# Altium schematic sheet BatteryCharger.SchDoc
size Tabloid
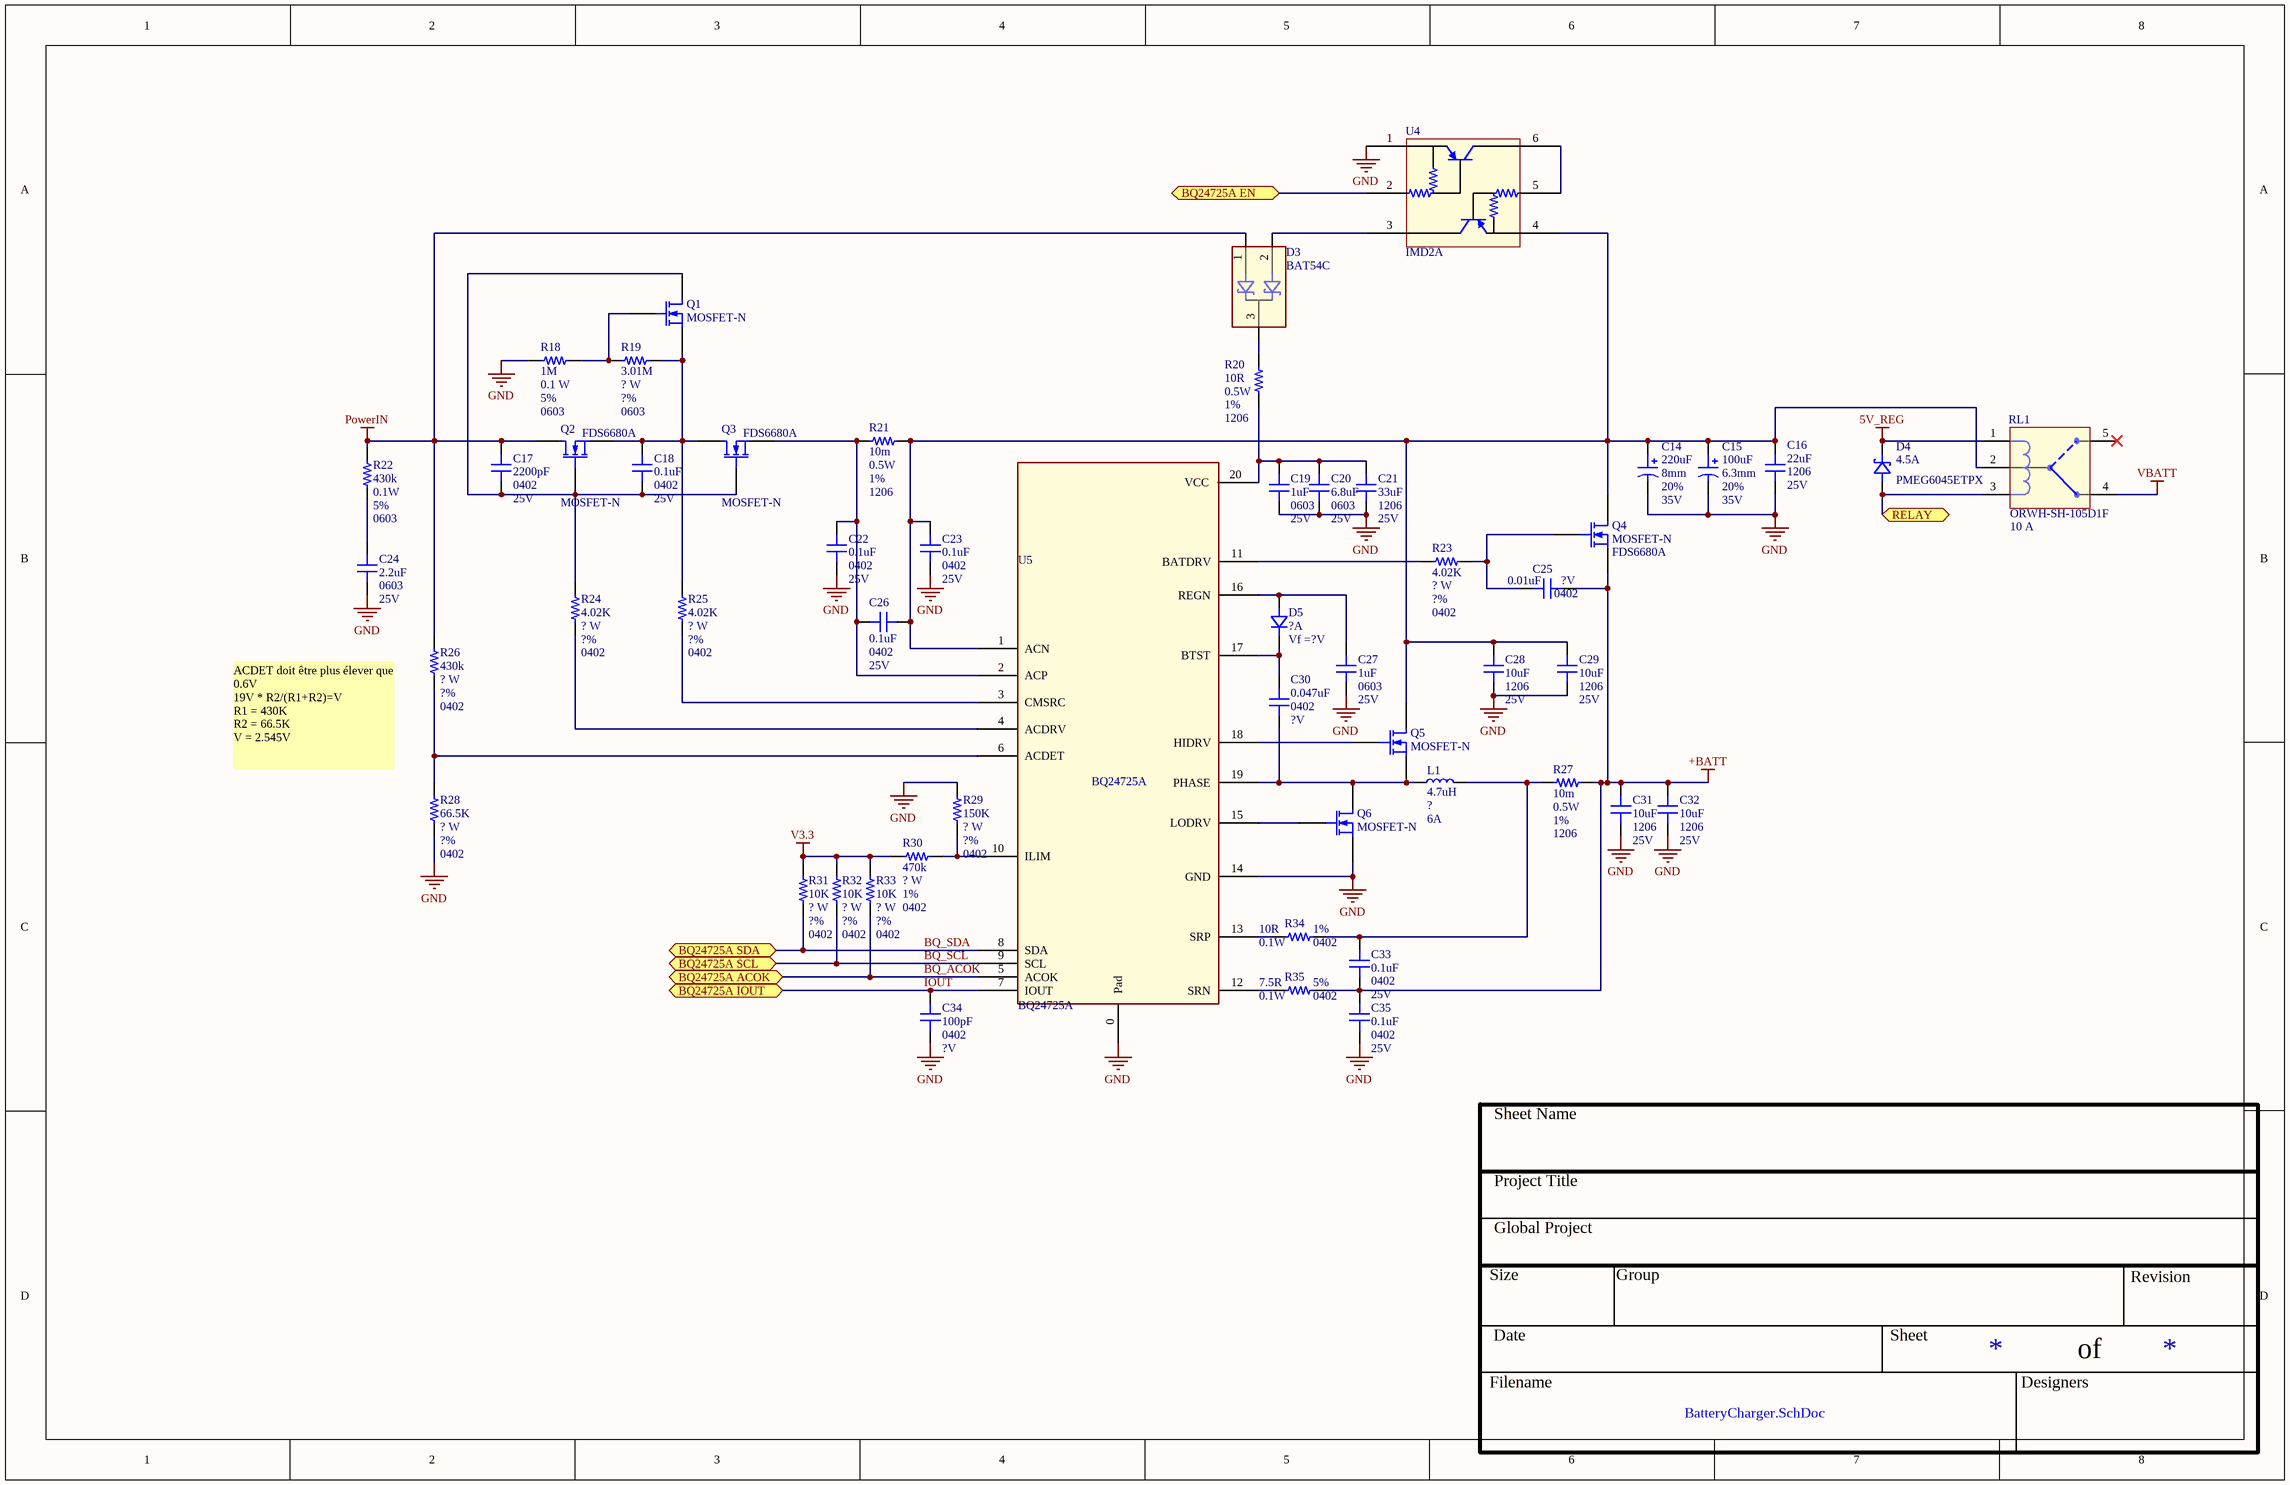
[diagram p0: BatteryCharger.SchDoc]

## Parts
C14  value 220uF  Package: 8mm  Tolerance: 20%  Voltage: 35V  [CAP UWT 8x10]  (hidden comment: CAP ALU - 6.3mm)
C15  value 100uF  Package: 6.3mm  Tolerance: 20%  Voltage: 35V  [CAP ALU - 6.3mm DIA]  (hidden comment: CAP ALU - 6.3mm)
C16  value 22uF  Package: 1206  Voltage: 25V  [CAP_1206]  (hidden comment: CAP - 1206)
C17  value 2200pF  Package: 0402  Voltage: 25V  [CAP_0402]  (hidden comment: CAP - 0402)
C18  value 0.1uF  Package: 0402  Voltage: 25V  [CAP_0402]  (hidden comment: CAP - 0402)
C19  value 1uF  Package: 0603  Voltage: 25V  [CAP_0603]  (hidden comment: CAP - 0603)
C20  value 6.8uF  Package: 0603  Voltage: 25V  [CAP_0603]  (hidden comment: CAP - 0603)
C21  value 33uF  Package: 1206  Voltage: 25V  [CAP_1206]  (hidden comment: CAP - 1206)
C22  value 0.1uF  Package: 0402  Voltage: 25V  [CAP_0402]  (hidden comment: CAP - 0402)
C23  value 0.1uF  Package: 0402  Voltage: 25V  [CAP_0402]  (hidden comment: CAP - 0402)
C24  value 2.2uF  Package: 0603  Voltage: 25V  [CAP_0603]  (hidden comment: CAP - 0603)
C25  value 0.01uF  Package: 0402  Voltage: ?V  [CAP_0402]  (hidden comment: CAP - 0402)
C26  value 0.1uF  Package: 0402  Voltage: 25V  [CAP_0402]  (hidden comment: CAP - 0402)
C27  value 1uF  Package: 0603  Voltage: 25V  [CAP_0603]  (hidden comment: CAP - 0603)
C28  value 10uF  Package: 1206  Voltage: 25V  [CAP_1206]  (hidden comment: CAP - 1206)
C29  value 10uF  Package: 1206  Voltage: 25V  [CAP_1206]  (hidden comment: CAP - 1206)
C30  value 0.047uF  Package: 0402  Voltage: ?V  [CAP_0402]  (hidden comment: CAP - 0402)
C31  value 10uF  Package: 1206  Voltage: 25V  [CAP_1206]  (hidden comment: CAP - 1206)
C32  value 10uF  Package: 1206  Voltage: 25V  [CAP_1206]  (hidden comment: CAP - 1206)
C33  value 0.1uF  Package: 0402  Voltage: 25V  [CAP_0402]  (hidden comment: CAP - 0402)
C34  value 100pF  Package: 0402  Voltage: ?V  [CAP_0402]  (hidden comment: CAP - 0402)
C35  value 0.1uF  Package: 0402  Voltage: 25V  [CAP_0402]  (hidden comment: CAP - 0402)
D3  BAT54C  [BAT54C]
D4  Current: 4.5A  Part number: PMEG6045ETPX  [DO-214AC_SOD128]  (hidden comment: SCHOTTKEY)
D5  Current: ?A  Vf: Vf =?V  [BAT54]  (hidden comment: DIODE BAT54)
L1  value 4.7uH  Current: 6A  [ASPI-0630LR]  (hidden comment: IND)
Q1  MOSFET-N  [PG-SOT-323]
Q2  MOSFET-N  Part number: FDS6680A  [SO-8 FDS6680AS]
Q3  MOSFET-N  Part number: FDS6680A  [SO-8 FDS6680AS]
Q4  MOSFET-N  Part number: FDS6680A  [SO-8 FDS6680AS]
Q5  MOSFET-N  [SiS412DN]
Q6  MOSFET-N  [SiS412DN]
R18  value 1M  Watt: 0.1 W  Tolerance: 5%  Package: 0603  [RES_0603]  (hidden comment: RES - 0603)
R19  value 3.01M  Watt: ? W  Tolerance: ?%  Package: 0603  [RES_0603]  (hidden comment: RES - 0603)
R20  value 10R  Watt: 0.5W  Tolerance: 1%  Package: 1206  [RES_1206]  (hidden comment: RES - 1206)
R21  value 10m  Watt: 0.5W  Tolerance: 1%  Package: 1206  [RES_1206]  (hidden comment: RES - 1206)
R22  value 430k  Watt: 0.1W  Tolerance: 5%  Package: 0603  [RES_0603]  (hidden comment: RES - 0603)
R23  value 4.02K  Watt: ? W  Tolerance: ?%  Package: 0402  [RES_0402]  (hidden comment: RES - 0402)
R24  value 4.02K  Watt: ? W  Tolerance: ?%  Package: 0402  [RES_0402]  (hidden comment: RES - 0402)
R25  value 4.02K  Watt: ? W  Tolerance: ?%  Package: 0402  [RES_0402]  (hidden comment: RES - 0402)
R26  value 430k  Watt: ? W  Tolerance: ?%  Package: 0402  [RES_0402]  (hidden comment: RES - 0402)
R27  value 10m  Watt: 0.5W  Tolerance: 1%  Package: 1206  [RES_1206]  (hidden comment: RES - 1206)
R28  value 66.5K  Watt: ? W  Tolerance: ?%  Package: 0402  [RES_0402]  (hidden comment: RES - 0402)
R29  value 150K  Watt: ? W  Tolerance: ?%  Package: 0402  [RES_0402]  (hidden comment: RES - 0402)
R30  value 470k  Watt: ? W  Tolerance: 1%  Package: 0402  [RES_0402]  (hidden comment: RES - 0402)
R31  value 10K  Watt: ? W  Tolerance: ?%  Package: 0402  [RES_0402]  (hidden comment: RES - 0402)
R32  value 10K  Watt: ? W  Tolerance: ?%  Package: 0402  [RES_0402]  (hidden comment: RES - 0402)
R33  value 10K  Watt: ? W  Tolerance: ?%  Package: 0402  [RES_0402]  (hidden comment: RES - 0402)
R34  value 10R  Watt: 0.1W  Tolerance: 1%  Package: 0402  [RES_0402]  (hidden comment: RES - 0402)
R35  value 7.5R  Watt: 0.1W  Tolerance: 5%  Package: 0402  [RES_0402]  (hidden comment: RES - 0402)
RL1  Part number: ORWH-SH-105D1F  A max: 10 A  [ORWH-SH]  (hidden comment: Relay SPDT)
U4  IMD2A  [IMD2A]
U5  BQ24725A  [bq24725A]

## Ports
BQ24725A ACOK, BQ24725A EN, BQ24725A IOUT, BQ24725A SCL, BQ24725A SDA, RELAY

## Nets
5V_REG: D4.2 RL1.1
+BATT: C25.2 C31.1 C32.1 C33.1 C35.2 Q4.3(S) R27.2 R35.2
GND: C14.2 C15.2 C16.2 C19.2 C20.2 C21.2 C22.1 C23.1 C24.2 C27.2 C28.2 C29.2 C31.2 C32.2 C34.2 C35.1 Q6.3(S) R18.1 R28.2 R29.2 U4.1 U5.0(Pad) U5.14(GND)
PowerIN: C17.2 D3.1 Q2.1(D) R22.1 R26.1
V3.3: R30.2 R31.1 R32.1 R33.1
VBATT: RL1.4
BQ24725A EN: U4.2 ; port BQ24725A EN
BQ_ACOK: R33.2 U5.5(ACOK) ; port BQ24725A ACOK
BQ_SCL: R32.2 U5.9(SCL) ; port BQ24725A SCL
BQ_SDA: R31.2 U5.8(SDA) ; port BQ24725A SDA
IOUT: C34.1 U5.7(IOUT) ; port BQ24725A IOUT
RELAY: D4.1 RL1.3 ; port RELAY
NetC14_1: C14.1 C15.1 C16.1 C23.2 C26.1 C28.1 C29.1 Q4.1(D) Q5.1(D) R21.2 RL1.2 U4.4 U5.1(ACN)
NetC17_1: C17.1 C18.1 Q1.3(D) Q2.2(G) Q3.2(G) R24.1
NetC18_2: C18.2 Q1.2(S) Q2.3(S) Q3.1(D) R19.2 R25.1
NetC19_1: C19.1 C20.1 C21.1 R20.1 U5.20(VCC)
NetC22_2: C22.2 C26.2 Q3.3(S) R21.1 U5.2(ACP)
NetC24_1: C24.1 R22.2
NetC25_1: C25.1 Q4.2(G) R23.2
NetC27_1: C27.1 D5.1 U5.16(REGN)
NetC30_1: C30.1 D5.3 U5.17(BTST)
NetC30_2: C30.2 L1.1 Q5.3(S) Q6.1(D) U5.19(PHASE)
NetC33_2: C33.2 L1.2 R27.1 R34.2
NetD3_2: D3.2 U4.3
NetD3_3: D3.3 R20.2
NetQ1_1: Q1.1(G) R18.2 R19.1
NetQ5_2: Q5.2(G) U5.18(HIDRV)
NetQ6_2: Q6.2(G) U5.15(LODRV)
NetR23_1: R23.1 U5.11(BATDRV)
NetR24_2: R24.2 U5.4(ACDRV)
NetR25_2: R25.2 U5.3(CMSRC)
NetR26_2: R26.2 R28.1 U5.6(ACDET)
NetR29_1: R29.1 R30.1 U5.10(ILIM)
NetR34_1: R34.1 U5.13(SRP)
NetR35_1: R35.1 U5.12(SRN)
NetU4_5: U4.5 U4.6

Not connected (* = marked no-connect by the designer): RL1 5*

## Notes on the sheet
- ACDET doit être plus élever que 0.6V
  19V * R2/(R1+R2)=V
  R1 = 430K
  R2 = 66.5K
  V = 2.545V
- Sheet Name
- Project Title
- Global Project
- Size
- Group
- Revision
- Date
- Sheet
- of
- Filename
- Designers

## Library data of the parts
C14 = CAP ALU - 6_3mm: Part number: UWT1E221MNL1GS
C15 = CAP ALU - 6_3mm: Part number: UWT1E101MCL1GS
C16 = CAP - 1206: Part number: CL31A226KAHNNNE
C17 = CAP - 0402: Part number: AC0402KRX7R8BB222
C18 C22 C23 C26 C33 C35 = CAP - 0402: Part number: CL05A104KA5NNNC
C19 C27 = CAP - 0603: Part number: CL10A105KA8NNNC
C20 = CAP - 0603: Part number: C1608X5R1E685K080AC
C21 = CAP - 1206: Part number: C3216JB1E336M160AC
C24 = CAP - 0603: Part number: GRM188R61E225KA12D
C25 = CAP - 0402: Part number: CL05B103KA5NNNC
C28 C29 C31 C32 = CAP - 1206: Part number: CL31A106KAHNFNE
C30 = CAP - 0402: Part number: C0402C473K3RACAUTO
C34 = CAP - 0402: Part number: CC0402KRX7R8BB101
D4 = SCHOTTKEY: Vf: Vf =0.33V
D5 = DIODE BAT54: Part number: BAT54C
L1 = IND: Part number: ASPI-0630LR-4R7M-T15; Package: ?
Q1 = MOSFET-N: N-Channel MOSFET; Part number: BSS138WH6327XTSA1; Published: 8-Jun-2000; LatestRevisionDate: 17-Jul-2002; LatestRevisionNote: Re-released for DXP Platform.; PackageVersion: 1995/1996; PackageReference: E3; Publisher: Altium Limited; PackageDescription: TO, Flat Index; 3 In-Line, Axial Leads; Body Dia. 4.6mm; Lead Dia. 0.5 mm (max)
Q2-Q4 = MOSFET-N: N-Channel MOSFET; Published: 8-Jun-2000; LatestRevisionDate: 17-Jul-2002; LatestRevisionNote: Re-released for DXP Platform.; PackageVersion: 1995/1996; PackageReference: E3; Publisher: Altium Limited; PackageDescription: TO, Flat Index; 3 In-Line, Axial Leads; Body Dia. 4.6mm; Lead Dia. 0.5 mm (max)
Q5 Q6 = MOSFET-N: N-Channel MOSFET; Part number: SIS412DN-T1-GE3; Published: 8-Jun-2000; LatestRevisionDate: 17-Jul-2002; LatestRevisionNote: Re-released for DXP Platform.; PackageVersion: 1995/1996; PackageReference: E3; Publisher: Altium Limited; PackageDescription: TO, Flat Index; 3 In-Line, Axial Leads; Body Dia. 4.6mm; Lead Dia. 0.5 mm (max)
R18 = RES - 0603: Part number: CRGCQ0603J1M0
R19 = RES - 0603: Part number: RC0603FR-073M01L
R20 = RES - 1206: Part number: CRM1206-FX-10R0ELF
R21 R27 = RES - 1206: Part number: KRL1632E-M-R010-F-T5
R22 = RES - 0603: Part number: RC0603JR-07430KL
R23-R25 = RES - 0402: Part number: ERJ-2RKF4021X
R26 = RES - 0402: Part number: RC0402FR-07430KL
R28 = RES - 0402: Part number: RMCF0402FT66K5
R29 = RES - 0402: Part number: MCS04020C1503FE000
R30 = RES - 0402: Part number: MCS04020C4703FE000
R31-R33 = RES - 0402: Part number: MCS0402MC1002FE000
R34 = RES - 0402: Part number: ERJ-2RKF10R0X
R35 = RES - 0402: Part number: ERJ-2GEJ7R5X
U4 = IMD2A: Dual digital Transistor; Part number: IMD2A
D3 = BAT54C: Part number: BAT54C